# EasyEDA Pro project 2025新M0板子工程.eprj, schematic Schematic1
Board Name: Board1; Create Date: 2025-07-04; Page Name: P1; Project Name: 2025新M0板子工程; Schematic Name: Schematic1; Update Date: 2025-07-05; Company: 嘉立创EDA; Page Size: A4; Version: V1.0
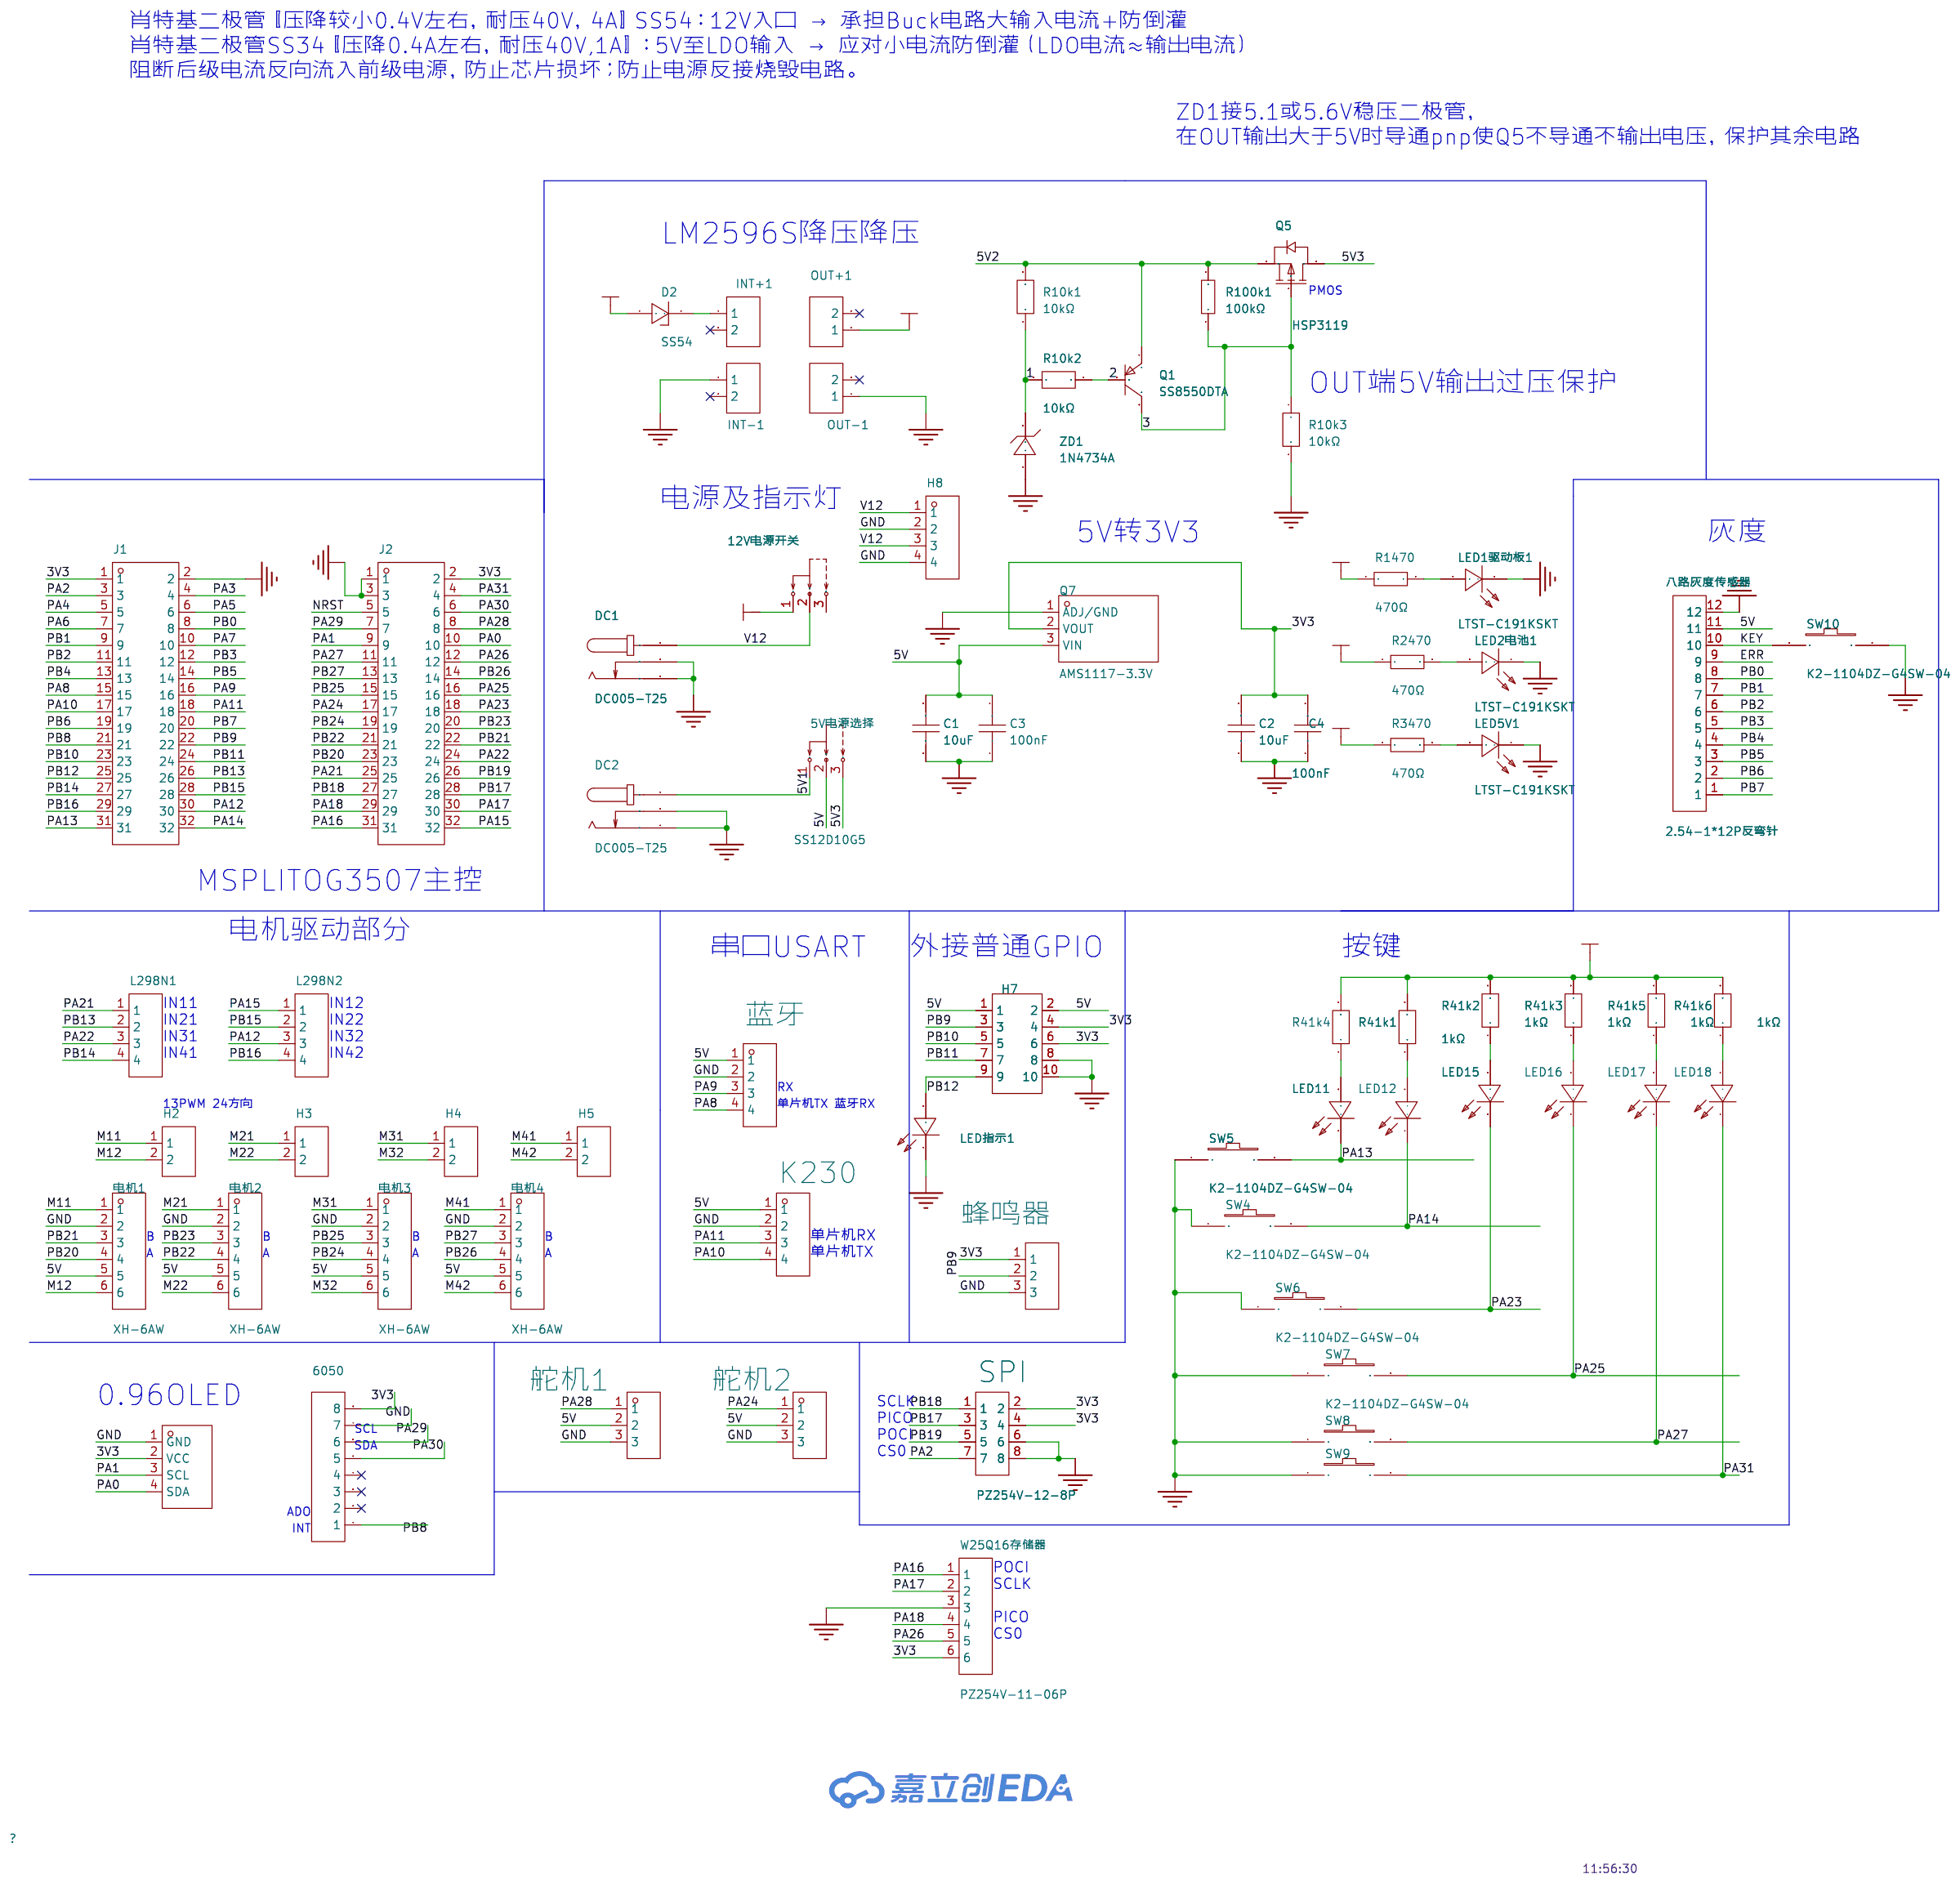
[diagram p0: schematic sheet]

## Parts
5V电源选择  SS12D10G5  [SW-TH_SHOU-HAN_SS12D10G4]
12V电源开关  SS12D10G5  [SW-TH_SHOU-HAN_SS12D10G4]
6050  2.54-1*8P母环保  [HDR-TH_8P-P2.54-V-F-1]
C1  10uF  [C0805]
C2  10uF  [C0805]
C3  100nF  [C0603]
C4  100nF  [C0603]
D2  SS54  [SMA_L4.3-W2.6-LS5.0-FD]
DC1  DC005-T25  [DC-IN-TH_DC-005-20A-1]
DC2  DC005-T25  [DC-IN-TH_DC-005-20A-1]
H2  PZ254V-11-02P  [HDR-TH_2P-P2.54-V-M]
H3  PZ254V-11-02P  [HDR-TH_2P-P2.54-V-M]
H4  PZ254V-11-02P  [HDR-TH_2P-P2.54-V-M]
H5  PZ254V-11-02P  [HDR-TH_2P-P2.54-V-M]
H7  PZ254V-12-10P  [HDR-TH_10P-P2.54-V-M-R2-C5-S2.54]
H8  PZ254V-11-04P  [HDR-TH_4P-P2.54-V-M]
INT+1  2.54-1*2P母  [HDR-TH_2P-P2.54-V-F]
INT-1  2.54-1*2P母  [HDR-TH_2P-P2.54-V-F]
J1  X6521FV-2x16-C85D32  [HDR-TH_32P-P2.54-V-F-R2-C16-S2.54]
J2  X6521FV-2x16-C85D32  [HDR-TH_32P-P2.54-V-F-R2-C16-S2.54]
K230  PZ254V-11-04P  [HDR-TH_4P-P2.54-V-M]
L298N1  2.54-1*4  [HDR-TH_4P-P2.54-V-M-1]
L298N2  2.54-1*4  [HDR-TH_4P-P2.54-V-M-1]
LED1驱动板1  LTST-C191KSKT  [LED0603-RD-YELLOW]
LED2电池1  LTST-C191KSKT  [LED0603-RD-YELLOW]
LED5V1  LTST-C191KSKT  [LED0603-RD-YELLOW]
LED11  LTST-C191KSKT  [LED0603-RD-YELLOW]
LED12  LTST-C191KSKT  [LED0603-RD-YELLOW]
LED15  LTST-C191KSKT  [LED0603-RD-YELLOW]
LED16  LTST-C191KSKT  [LED0603-RD-YELLOW]
LED17  LTST-C191KSKT  [LED0603-RD-YELLOW]
LED18  LTST-C191KSKT  [LED0603-RD-YELLOW]
LED指示1  LTST-C191KSKT  [LED0603-RD-YELLOW]
OLED1  HS96L03W2C03  [OLED-TH_L27.8-W27.2-P2.54_C9900033791]
OUT+1  2.54-1*2P母  [HDR-TH_2P-P2.54-V-F]
OUT-1  2.54-1*2P母  [HDR-TH_2P-P2.54-V-F]
Q1  SS8550DTA  [TO-92-3_L4.8-W3.7-P2.54-L]
Q5  HSP3119  [TO-220-3_L10.2-W4.5-P2.54-L-1]
Q7  AMS1117-3.3V  [SOT-89-3_L4.5-W2.5-P1.50-LS4.2-BR]
R10k1  10kΩ  [RES-TH_BD2.4-L6.3-P10.30-D0.6]
R10k2  10kΩ  [RES-TH_BD2.4-L6.3-P10.30-D0.6]
R10k3  10kΩ  [RES-TH_BD2.4-L6.3-P10.30-D0.6]
R41k1  1kΩ  [R0603]
R41k2  1kΩ  [R0603]
R41k3  1kΩ  [R0603]
R41k4  1kΩ  [R0603]
R41k5  1kΩ  [R0603]
R41k6  1kΩ  [R0603]
R100k1  100kΩ  [RES-TH_BD2.7-L6.2-P10.20-D0.4]
R1470  470Ω  [R0603]
R2470  470Ω  [R0603]
R3470  470Ω  [R0603]
SPI  PZ254V-12-8P  [HDR-TH_8P-P2.54-V-M-R2-C4-S2.54]
SW4  K2-1104DZ-G4SW-04  [KEY-TH_2P-L6.0-W6.0-P5.00]
SW5  K2-1104DZ-G4SW-04  [KEY-TH_2P-L6.0-W6.0-P5.00]
SW6  K2-1104DZ-G4SW-04  [KEY-TH_2P-L6.0-W6.0-P5.00]
SW7  K2-1104DZ-G4SW-04  [KEY-TH_2P-L6.0-W6.0-P5.00]
SW8  K2-1104DZ-G4SW-04  [KEY-TH_2P-L6.0-W6.0-P5.00]
SW9  K2-1104DZ-G4SW-04  [KEY-TH_2P-L6.0-W6.0-P5.00]
SW10  K2-1104DZ-G4SW-04  [KEY-TH_2P-L6.0-W6.0-P5.00]
W25Q16存储器  PZ254V-11-06P  [HDR-TH_6P-P2.54-V-M]
ZD1  1N4734A  [DO-41_BD2.8-L4.2-P8.00-D0.7-FD]
八路灰度传感器  2.54-1*12P反弯针  [HDR-TH_12P-P2.54-H-M-W10.5]
电机1  XH-6AW  [CONN-TH_6P-P2.54_HCTL_XH-6AW_C2908615]
电机2  XH-6AW  [CONN-TH_6P-P2.54_HCTL_XH-6AW_C2908615]
电机3  XH-6AW  [CONN-TH_6P-P2.54_HCTL_XH-6AW_C2908615]
电机4  XH-6AW  [CONN-TH_6P-P2.54_HCTL_XH-6AW_C2908615]
舵机1  舵机  [HDR-TH_3P-P2.54-V-F]
舵机2  舵机  [HDR-TH_3P-P2.54-V-F]
蓝牙  2.54-1*4P母  [HDR-TH_4P-P2.54-V-F]
蜂鸣器  PZ254V-11-03P  [HDR-TH_3P-P2.54-V-M]

## Library data of the parts
5V电源选择 12V电源开关 = SS12D10G5: 电路结构:单刀双掷;安装方式:直插;额定电流(DC):2A;额定电压(DC):125V;机械寿命:3千次;; LCSC Part Name: 两档立式插件 3脚拨动开关 柄长5.0mm; Supplier Part: C7431054; Manufacturer: SHOU HAN(首韩); Supplier Footprint: 插件; JLCPCB Part Class: 扩展库; Datasheet: https://atta.szlcsc.com/upload/public/pdf/source/20231130/7A3DB6A149BF0A1DCFFE64FFC07FE434.pdf; Supplier: LCSC; Circuit: 单刀双掷; Switch Length: 12.7mm; Switch Width: 6.7mm; Mounting Style: 直插; Current Rating (DC): 2A; Voltage Rating (DC): 125V; Mechanical Life: 3千次; Operating Temperature: -25℃~+70℃
6050 = 2.54-1*8P母环保: 插孔结构:1x8P;间距:2.54mm;行距:-;安装类型:直插;排数:单排;总孔位数:8P;塑高:-;触头材质:-;触头镀层:-;; LCSC Part Name: 间距:2.54mm 1x8P 直插; Supplier Part: C27438; Manufacturer: BOOMELE(博穆精密); Supplier Footprint: 插件,P=2.54mm; JLCPCB Part Class: 扩展库; Datasheet: https://atta.szlcsc.com/upload/public/pdf/source/20231221/1CA800C6799ED97958773716FAA1BFFE.pdf; Supplier: LCSC; Holes Structure: 1x8P; Pitch: 2.54mm; Mounting Type: 直插; Number of Rows: 单排; Number of Holes: 8P
C1 C2 = CGA0805X5R106K250MT: LCSC Part Name: 10uF ±10% 25V; Supplier Part: C6119887; Manufacturer: HRE(芯声); Supplier Footprint: 0805; JLCPCB Part Class: 扩展库; Supplier: LCSC; Tolerance: ±10%; Voltage Rating: 25V; Temperature Coefficient: X5R
C3 C4 = CGA0603X7R104K500JT: LCSC Part Name: 100nF ±10% 50V; Supplier Part: C6119867; Manufacturer: HRE(芯声); Supplier Footprint: 0603; JLCPCB Part Class: 扩展库; Datasheet: https://atta.szlcsc.com/upload/public/pdf/source/20250103/C44077DA9E7B3EFAE02F22B6D3D1CBC9.pdf; Supplier: LCSC; Tolerance: ±10%; Voltage Rating: 50V; Temperature Coefficient: X7R
D2 = SS54_C7420369: LCSC Part Name: 电压:40V 电流:5A; Supplier Part: C7420369; Manufacturer: 宏迦橙; Supplier Footprint: SMA(DO-214AC); JLCPCB Part Class: 扩展库; Datasheet: https://atta.szlcsc.com/upload/public/pdf/source/20230828/254C3882F8647358AD9F60DD73611B5E.pdf; Supplier: LCSC; Diode Configuration: 独立式; Forward Voltage (Vf@If): 550mV@5.0A; Reverse Voltage (Vr): 40V; Rectified Current: 5A; Reverse Leakage Current (Ir): 50uA@40V
DC1 DC2 = DC005-T25: 触点内径:2.5mm;触点外径:6.3mm;额定电流:-;额定电压:-;; LCSC Part Name: 内径:2.5mm 外径:6.3mm; Supplier Part: C111573; Manufacturer: SOFNG(硕方); Supplier Footprint: 插件; JLCPCB Part Class: 扩展库; Datasheet: https://atta.szlcsc.com/upload/public/pdf/source/20211217/AAF92010038535095742900872F779AE.pdf; Supplier: LCSC; Inside Contact Diameter: 2.5mm; Outside Contact Diameter: 6.3mm
H2-H5 = PZ254V-11-02P: LCSC Part Name: 1x2P 间距:2.54mm 方针 直插; Supplier Part: C492401; Manufacturer: XFCN(兴飞); Supplier Footprint: 插件,P=2.54mm; JLCPCB Part Class: 扩展库; Datasheet: https://atta.szlcsc.com/upload/public/pdf/source/20200309/C492401_A812433581A9B211A7FFA413ADDFF0E5.pdf; Supplier: LCSC; Pin Structure: 1x2P; Pitch: 2.54mm; Circluar Pins/Square Pins: 方针; Mounting Type: 直插; Number of Rows: 单排; Number of Pins: 2P; Length of Mating Pin: 6mm; Insulation Height: 2.5mm; Length of End Connection Pin: 3mm; Contact Material: 黄铜; Operating Temperature: -40℃~+105℃; Color: 黑色
H7 = PZ254V-12-10P: LCSC Part Name: 2x5P 间距:2.54mm 方针 直插; Supplier Part: C492422; Manufacturer: XFCN(兴飞); Supplier Footprint: 插件,P=2.54mm; JLCPCB Part Class: 扩展库; Datasheet: https://atta.szlcsc.com/upload/public/pdf/source/20200309/C492422_5020CEA01BE7051F9EA9DD81AB0A25E3.pdf; Supplier: LCSC; Pin Structure: 2x5P; Pitch: 2.54mm; Row Spacing: 2.54mm; Circluar Pins/Square Pins: 方针; Mounting Type: 直插; Number of Rows: 双排; Number of Pins: 10P; Length of Mating Pin: 6mm; Insulation Height: 2.5mm; Length of End Connection Pin: 3mm; Contact Material: 黄铜; Operating Temperature: -40℃~+105℃; Color: 黑色
H8 K230 = PZ254V-11-04P: 插针结构:1x4P;间距:2.54mm;行距:-;圆针/方针:方针;安装类型:直插;排数:单排;总PIN位数:4P;额定电流:3A;额定电压:250V;配合针长度:6mm;塑高:2.5mm;端接针长度:3mm;触头材质:-;工作温度范围:-40℃~+105℃;颜色:黑色;; LCSC Part Name: 间距:2.54mm 1x4P 直插 方针; Supplier Part: C2691448; Manufacturer: XFCN(兴飞); Supplier Footprint: 插件,P=2.54mm; JLCPCB Part Class: 扩展库; Datasheet: https://atta.szlcsc.com/upload/public/pdf/source/20200309/C492403_F9F19131791D08044AD4F84F8E751A34.pdf; Supplier: LCSC; Pin Structure: 1x4P; Pitch: 2.54mm; Circluar Pins/Square Pins: 方针; Mounting Type: 直插; Number of Rows: 单排; Number of Pins: 4P; Current Rating (Max): 3A; Voltage Rating (Max): 250V; Length of Mating Pin: 6mm; Insulation Height: 2.5mm; Length of End Connection Pin: 3mm; Operating Temperature Range: -40℃~+105℃; Color: 黑色
INT+1 INT-1 OUT+1 OUT-1 = 2.54-1*2P母: 插孔结构:1x2P;间距:2.54mm;行距:-;安装类型:直插;排数:单排;总孔位数:2P;塑高:-;触头材质:-;触头镀层:-;; LCSC Part Name: 间距:2.54mm 1x2P 直插; Supplier Part: C49661; Manufacturer: BOOMELE(博穆精密); Supplier Footprint: 插件,P=2.54mm; JLCPCB Part Class: 扩展库; Datasheet: https://atta.szlcsc.com/upload/public/pdf/source/20210301/C2718488_F4427B881E42CAA8DDB0B1C12B3A522C.pdf; Supplier: LCSC; Holes Structure: 1x2P; Pitch: 2.54mm; Mounting Type: 直插; Number of Rows: 单排; Number of Holes: 2P
J1 J2 = X6521FV-2x16-C85D32: LCSC Part Name: 间距:2.54mm 2x16P 直插; Supplier Part: C2883989; Manufacturer: XKB Connection(中国星坤); Supplier Footprint: 插件,P=2.54mm; JLCPCB Part Class: 扩展库; Datasheet: https://atta.szlcsc.com/upload/public/pdf/source/20211009/C636DBF0733662F7F428F4420CCBBD46.pdf; Supplier: LCSC; Holes Structure: 2x16P; Pitch: 2.54mm; Row Spacing: 2.54mm; Circular Hole / Square Hole: 方孔; Mounting Type: 直插; Number of Rows: 双排; Number of Holes: 32P; Current Rating (Max): 3A; Voltage Rating (Max): 250V; Holes Direction: 顶部; Insulation Height: 8.5mm; Contact Material: 黄铜; Contact Plating: 金; Operating Temperature Range: -40℃~+105℃; Soldering Temperature(Max): 260℃
L298N1 L298N2 = 2.54-1*4: Supplier Part: C5116483; Manufacturer: ZHOURI(洲日); Supplier Footprint: 插件,P=2.54mm; JLCPCB Part Class: 扩展库; Datasheet: https://atta.szlcsc.com/upload/public/pdf/source/20250227/F941FC765EF241ABFB2D5D72948A31A5.pdf; Supplier: LCSC; Pin Structure: 1x4P; Pitch: 2.54mm; Number of Rows: 单排; Number of Pins: 4P
LED1驱动板1 LED2电池1 LED5V1 LED11 LED12 LED15-LED18 LED指示1 = LTST-C191KSKT: 发光颜色:黄色;正向电压(VF):2.1V;功率:75mW;正向电流:20mA;主波长:584.5nm~597nm;二极管配置:-;透镜颜色:无色透明透镜;色温:-;发光强度:104mcd;发光角度:130°;载带方式:-;工作温度:-55℃~+85℃;; LCSC Part Name: 黄灯; Supplier Part: C125100; Manufacturer: LITEON(光宝); Supplier Footprint: 0603; JLCPCB Part Class: 扩展库; Datasheet: https://atta.szlcsc.com/upload/public/pdf/source/20180129/C125100_15171877314981315871.pdf; Supplier: LCSC; Emitted Color: 黄色; Forward Voltage (VF): 2.1V; Power Dissipation: 75mW; Forward Current: 20mA; Dominant Wavelength: 584.5nm~597nm; Peak Wavelength: 588nm; Lens Color: 无色透明透镜; Luminous Intensity: 104mcd; Viewing Angle: 130°; Operating Temperature: -55℃~+85℃
OLED1 = HS96L03W2C03: 主控芯片:SSD1315;接口类型:I2C;尺寸(inch):0.96;像素分辨率:128x64;; LCSC Part Name: 0.96寸OLED显示屏窄白光IIC; Supplier Part: C5248080; Manufacturer: HS(汉昇); JLCPCB Part Class: 扩展库; Datasheet: https://atta.szlcsc.com/upload/public/pdf/source/20230627/763D01F79A90007632F098068C7C8AD9.pdf; Supplier: LCSC; Main Control Chip: SSD1315; Interface Type: I2C; Size: 0.96; Pixel Resolution: 128x64; Operating Temperature: -40℃~+70℃
Q1 = SS8550DTA: 晶体管类型:PNP;集电极电流(Ic):1.5A;集射极击穿电压(Vceo):25V;功率(Pd):2W;直流电流增益(hFE@Ic,Vce):40@800mA,1V;; LCSC Part Name: PNP 电流:1.5A 耐压:25V; Supplier Part: C903228; Manufacturer: onsemi(安森美); Supplier Footprint: TO-92-3; JLCPCB Part Class: Extended Part; Datasheet: https://atta.szlcsc.com/upload/public/pdf/source/20221020/9DBCD1C6A257D06DE4F9043ED0140297.pdf; Supplier: LCSC; Transistor Type: PNP; Collector Current (Ic): 1.5A; Collector-Emitter Breakdown Voltage (Vceo): 25V; Power Dissipation (Pd): 2W; DC Current Gain (hFE@Ic,Vce): 40@800mA,1V; Transition Frequency (fT): 100MHz; Collector Cut-Off Current (Icbo): 100nA; Collector-Emitter Saturation Voltage (VCE(sat)@Ic,Ib): 280mV@800mA,80mA; Operating Temperature: -65℃~+150℃
Q5 = HSP3119: 类型:1个P沟道;漏源电压(Vdss):30V;连续漏极电流(Id):150A;导通电阻(RDS(on)):-;耗散功率(Pd):200W;阈值电压(Vgs(th)):2.5V;; LCSC Part Name: 1个P沟道 耐压:30V 电流:150A; Supplier Part: C22359262; Manufacturer: HUASHUO(华朔); Supplier Footprint: TO-220; JLCPCB Part Class: Extended Part; Datasheet: https://atta.szlcsc.com/upload/public/pdf/source/20240313/B2043F85A28365E5AF5F107A9C9B0F2E.pdf; Supplier: LCSC; Type: 1个P沟道; Drain to Source Voltage: 30V; Current - Continuous Drain(Id): 150A; Pd - Power Dissipation: 200W; Gate Threshold Voltage (Vgs(th)@Id): 2.5V; Input Capacitance(Ciss@Vds): 12.7nF@15V; Reverse Transfer Capacitance (Crss@Vds): 1.21nF@15V; Operating Temperature: -55℃~+150℃@(Tj)
Q7 = AMS1117-3.3V_C5120796: LCSC Part Name: 输入18V 输出3.3V 1A; Supplier Part: C5120796; Manufacturer: MSKSEMI(美森科); Supplier Footprint: SOT-89; JLCPCB Part Class: 扩展库; Datasheet: https://atta.szlcsc.com/upload/public/pdf/source/20240731/7960C38D2F7D4AC8FF3CFA386029A4C5.pdf; Supplier: LCSC; Output Type: 固定; Voltage - Supply: 18V; Output Voltage: 3.3V; Output Current: 1A; Voltage Dropout: 1.4V@(1A); standby current: 12mA; Operating Temperature: 0℃~+125℃; Output Configuration: 正极; Number of Outputs: 1
R10k1-R10k3 = RN1/4W10KFT/BA1: 电阻类型:金属膜电阻;阻值:10kΩ;精度:±1%;功率:250mW;温度系数:±50ppm/℃;; LCSC Part Name: 10kΩ ±1% 250mW 金属膜电阻; Supplier Part: C410695; Manufacturer: Tyohm(幸亚电阻); Supplier Footprint: 插件,D2.4xL6.5mm; JLCPCB Part Class: Extended Part; Datasheet: https://atta.szlcsc.com/upload/public/pdf/source/20190808/C410699_D126E64D28B638F1D73B58E9F61DFD9B.pdf; Supplier: LCSC; Type: 金属膜电阻; Tolerance: ±1%; Overload Voltage (Max): 250V; Power(Watts): 250mW; Temperature Coefficient: ±50ppm/℃; Operating Temperature Range: -55℃~+125℃
R41k1-R41k6 = FCR0603F1K: 电阻类型:厚膜电阻;阻值:1kΩ;精度:±1%;功率:100mW;最大工作电压:75V;; LCSC Part Name: 1K ±1%; Supplier Part: C5913168; Manufacturer: VO(翔胜); Supplier Footprint: 0603; JLCPCB Part Class: 扩展库; Datasheet: https://atta.szlcsc.com/upload/public/pdf/source/20230428/98B65D379E9BA4CF2A9223D1647B01B6.pdf; Supplier: LCSC; Type: 厚膜电阻; Tolerance: ±1%; Power(Watts): 100mW; Overload Voltage (Max): 75V; Operating Temperature Range: -55℃~+155℃
R100k1 = MF1/4W-100K±1%-OT26: 电阻类型:金属膜电阻;阻值:100kΩ;精度:±1%;功率:250mW;温度系数:±350ppm/℃;; LCSC Part Name: 金属膜电阻 100kΩ ±1% 250mW; Supplier Part: C2843019; Manufacturer: VO(翔胜); Supplier Footprint: 插件,D2.7xL6.2mm; JLCPCB Part Class: Extended Part; Datasheet: https://atta.szlcsc.com/upload/public/pdf/source/20200609/C601728_5AA4C0C8E12E11069DA2C3356F29D1F2.pdf; Supplier: LCSC; Type: 金属膜电阻; Tolerance: ±1%; Overload Voltage (Max): 250V; Power(Watts): 250mW; Temperature Coefficient: ±350ppm/℃; Operating Temperature Range: -55℃~+155℃
R1470 R2470 R3470 = 0603WAF4700T5E: 电阻类型:厚膜电阻;阻值:470Ω;精度:±1%;功率:100mW;最大工作电压:75V;温度系数:±100ppm/℃;; LCSC Part Name: 470Ω ±1% 100mW 厚膜电阻; Supplier Part: C23179; Manufacturer: UNI-ROYAL(厚声); Supplier Footprint: 0603; JLCPCB Part Class: 基础库; Datasheet: https://atta.szlcsc.com/upload/public/pdf/source/20200306/C422600_1E6D84923E4A46A82E41ADD87F860B5C.pdf; Supplier: LCSC; Type: 厚膜电阻; Tolerance: ±1%; Power(Watts): 100mW; Overload Voltage (Max): 75V; Temperature Coefficient: ±100ppm/℃; Operating Temperature Range: -55℃~+155℃
SPI = PZ254V-12-8P: LCSC Part Name: 2x4P 间距:2.54mm 方针 直插; Supplier Part: C492421; Manufacturer: XFCN(兴飞); Supplier Footprint: 插件,P=2.54mm; JLCPCB Part Class: 扩展库; Datasheet: https://atta.szlcsc.com/upload/public/pdf/source/20200309/C492421_DC8A206AF99CD7755BD4A5B0BC48200B.pdf; Supplier: LCSC; Pin Structure: 2x4P; Pitch: 2.54mm; Row Spacing: 2.54mm; Circluar Pins/Square Pins: 方针; Mounting Type: 直插; Number of Rows: 双排; Number of Pins: 8P; Length of Mating Pin: 6mm; Insulation Height: 2.5mm; Length of End Connection Pin: 3mm; Contact Material: 黄铜; Operating Temperature: -40℃~+105℃; Color: 黑色
SW4-SW10 = K2-1104DZ-G4SW-04: 作用力:250gf;安装方式:直插;开关长度:6mm;开关宽度:6mm;开关高度:7mm;触点电流:50mA;额定电压(DC):12V;绝缘电阻:100MΩ;机械寿命:10万次;; LCSC Part Name: 6*6*7 两脚长脚开关; Supplier Part: C961736; Manufacturer: 韩国韩荣; Supplier Footprint: 插件; JLCPCB Part Class: 扩展库; Datasheet: https://atta.szlcsc.com/upload/public/pdf/source/20201126/C961736_4F85C6E6E5B3656D5DC7C0B00D034F4A.pdf; Supplier: LCSC; Operating Force: 250gf; Mounting Style: 直插; Switch Length: 6mm; Switch Width: 6mm; Switch Height: 7mm; Contact Current: 50mA; Voltage Rating (DC): 12V; Insulation Resistance: 100MΩ; Mechanical Life: 10万次; Operating Temperature: -25℃~+85℃
W25Q16存储器 = PZ254V-11-06P: LCSC Part Name: 1x6P 间距:2.54mm 方针 直插; Supplier Part: C492405; Manufacturer: XFCN(兴飞); Supplier Footprint: 插件,P=2.54mm; JLCPCB Part Class: 扩展库; Datasheet: https://atta.szlcsc.com/upload/public/pdf/source/20200309/C492405_597F1930F5B55CC3C7FD95458F1C3977.pdf; Supplier: LCSC; Pin Structure: 1x6P; Pitch: 2.54mm; Circluar Pins/Square Pins: 方针; Mounting Type: 直插; Number of Rows: 单排; Number of Pins: 6P; Length of Mating Pin: 6mm; Insulation Height: 2.5mm; Length of End Connection Pin: 3mm; Contact Material: 黄铜; Operating Temperature: -40℃~+105℃; Color: 黑色
ZD1 = 1N4734A_C41430: 二极管配置:独立式;稳压值(标称值):5.6V;耗散功率(Pd):-;; LCSC Part Name: 编带 1N4734A; Supplier Part: C41430; Manufacturer: ST(先科); Supplier Footprint: DO-41; JLCPCB Part Class: Extended Part; Datasheet: https://atta.szlcsc.com/upload/public/pdf/source/20170719/C118641_1500457766301828347.pdf; Supplier: LCSC; Diode Configuration: 独立式; Zener Voltage(Nom): 5.6V; Reverse Leakage Current (Ir): 10uA@2V; Impedance(Zzt): 5Ω
八路灰度传感器 = 2.54-1*12P反弯针_C725243: LCSC Part Name: 1x12P 间距:2.54mm 方针 弯插; Supplier Part: C725243; Manufacturer: BOOMELE(博穆精密); Supplier Footprint: 弯插,P=2.54mm; JLCPCB Part Class: 扩展库; Datasheet: https://atta.szlcsc.com/upload/public/pdf/source/20190508/C74252_03DDEC4696EE17172E44B96636392962.pdf; Supplier: LCSC; Pin Structure: 1x12P; Pitch: 2.54mm; Circluar Pins/Square Pins: 方针; Mounting Type: 弯插; Number of Rows: 单排; Number of Pins: 12P; Current Rating: 3A; Length of Mating Pin: 6mm; Operating Temperature: -55℃~+105℃; Color: 黑色
电机1-电机4 = XH-6AW: LCSC Part Name: 1x6P 间距:2.5mm 弯插 系列:XH; Supplier Part: C2908615; Manufacturer: HCTL(华灿天禄); Supplier Footprint: 弯插,P=2.5mm; JLCPCB Part Class: 扩展库; Datasheet: https://atta.szlcsc.com/upload/public/pdf/source/20230711/B565BAF3B11666EF6B81B3605408F2BD.pdf; Supplier: LCSC; Pins Structure: 1x6P; Pitch: 2.5mm; Mounting Style: 弯插; Reference Series: XH; Number of Pins: 6P; Number of Rows: 1; Number of PINs Per Row: 6; Current Rating (Max): 3A; Contact Material: 黄铜; Contact Plating: 锡; Operating Temperature Range: -25℃~+85℃
舵机1 舵机2 = PM254V-11-03-H85: 插孔结构:1x3P;间距:2.54mm;行距:-;安装类型:直插;排数:单排;总孔位数:3P;塑高:-;触头材质:黄铜;触头镀层:-;; LCSC Part Name: 间距:2.54mm 1x3P 直插; Supplier Part: C541850; Manufacturer: XFCN(兴飞); Supplier Footprint: 插件,P=2.54mm; JLCPCB Part Class: 扩展库; Datasheet: https://atta.szlcsc.com/upload/public/pdf/source/20200518/C541849_85853D71FC67C51915A806977A588FDA.pdf; Supplier: LCSC; Holes Structure: 1x3P; Pitch: 2.54mm; Mounting Type: 直插; Number of Rows: 单排; Number of Holes: 3P; Contact Material: 黄铜
蓝牙 = 2.54-1*4P母: 插孔结构:1x4P;间距:2.54mm;行距:-;圆孔/方孔:方孔;安装类型:直插;排数:单排;总孔位数:4P;额定电流:3A;额定电压:-;插孔方向:顶部;塑高:-;触头材质:青铜;触头镀层:-;工作温度范围:-40℃~+105℃;焊接温度(最大值):-;; LCSC Part Name: 间距:2.54mm 1x4P 直插; Supplier Part: C2718488; Manufacturer: BOOMELE(博穆精密); Supplier Footprint: 插件,P=2.54mm; JLCPCB Part Class: 扩展库; Datasheet: https://atta.szlcsc.com/upload/public/pdf/source/20210301/C2718488_F4427B881E42CAA8DDB0B1C12B3A522C.pdf; Supplier: LCSC; Holes Structure: 1x4P; Pitch: 2.54mm; Circular Hole / Square Hole: 方孔; Mounting Type: 直插; Number of Rows: 单排; Number of Holes: 4P; Current Rating (Max): 3A; Holes Direction: 顶部; Contact Material: 青铜; Operating Temperature Range: -40℃~+105℃
蜂鸣器 = PZ254V-11-03P: 插针结构:1x3P;间距:2.54mm;行距:-;圆针/方针:方针;安装方式:直插;排数:单排;总PIN位数:3P;额定电流:3A;额定电压:250V;配合针长度:6mm;塑高:2.5mm;端接针长度:3mm;工作温度:-40℃~+105℃;颜色:黑色;; LCSC Part Name: 1x3P 间距:2.54mm 方针 直插; Supplier Part: C2937625; Manufacturer: XFCN(兴飞); Supplier Footprint: 插件,P=2.54mm; JLCPCB Part Class: 扩展库; Datasheet: https://atta.szlcsc.com/upload/public/pdf/source/20200309/C492402_8335C3D49C4E4C618838D59BB1D024C1.pdf; Supplier: LCSC; Pin Structure: 1x3P; Pitch: 2.54mm; Circluar Pins/Square Pins: 方针; Mounting Type: 直插; Number of Rows: 单排; Number of Pins: 3P; Current Rating: 3A; Voltage Rating (Max): 250V; Length of Mating Pin: 6mm; Insulation Height: 2.5mm; Length of End Connection Pin: 3mm; Operating Temperature: -40℃~+105℃; Color: 黑色

## Nets
3V3: 6050.8 C2.2 C4.2 H7.4 H7.6 J1.1 J2.2 OLED1.2(VCC) Q7.2(VOUT) R41k1.2 R41k2.2 R41k3.2 R41k4.2 R41k5.2 R41k6.2 R2470.1 SPI.2 SPI.4 W25Q16存储器.6 蜂鸣器.1
5V: 5V电源选择.2 C1.2 C3.2 H7.1 H7.2 K230.1 Q7.3(VIN) R3470.1 八路灰度传感器.11 电机1.5 电机2.5 电机3.5 电机4.5 舵机1.2 舵机2.2 蓝牙.1
5V1: 5V电源选择.1 DC2.1
5V2: OUT+1.1 Q1.1(E) Q5.3(S) R10k1.2 R100k1.2
5V3: 5V电源选择.3 Q5.2(D)
12V: 12V电源开关.1 D2.1(A) R1470.1
GND: 6050.7 C1.1 C2.1 C3.1 C4.1 DC1.2 DC1.3 DC2.2 DC2.3 H7.8 H7.10 H8.2 H8.4 INT-1.1 J1.2 J2.1 J2.3 K230.2 LED1驱动板1.1(-) LED2电池1.1(-) LED5V1.1(-) LED指示1.1(-) OLED1.1(GND) OUT-1.1 Q7.1(ADJ/GND) R10k3.2 SPI.6 SPI.8 SW4.1 SW5.1 SW6.1 SW7.1 SW8.1 SW9.1 SW10.2 W25Q16存储器.3 ZD1.1(A) 八路灰度传感器.12 电机1.2 电机2.2 电机3.2 电机4.2 舵机1.3 舵机2.3 蓝牙.2 蜂鸣器.3
V12: 12V电源开关.2 DC1.1 H8.1 H8.3
1: R10k1.1 R10k2.2 ZD1.2(K)
2: Q1.2(B) R10k2.1
3: Q1.3(C) Q5.1(G) R10k3.1 R100k1.1
ERR: 八路灰度传感器.9
KEY: SW10.1 八路灰度传感器.10
M11: H2.1 电机1.1
M12: H2.2 电机1.6
M21: H3.1 电机2.1
M22: H3.2 电机2.6
M31: H4.1 电机3.1
M32: H4.2 电机3.6
M41: H5.1 电机4.1
M42: H5.2 电机4.6
NRST: J2.5
PA0: J2.10 OLED1.4(SDA)
PA1: J2.9 OLED1.3(SCL)
PA2: J1.3 SPI.7
PA3: J1.4
PA4: J1.5
PA5: J1.6
PA6: J1.7
PA7: J1.10
PA8: J1.15 蓝牙.4
PA9: J1.16 蓝牙.3
PA10: J1.17 K230.4
PA11: J1.18 K230.3
PA12: J1.30 L298N2.3
PA13: J1.31 LED11.1(-) SW5.2
PA14: J1.32 LED12.1(-) SW4.2
PA15: J2.32 L298N2.1
PA16: J2.31 W25Q16存储器.1
PA17: J2.30 W25Q16存储器.2
PA18: J2.29 W25Q16存储器.4
PA21: J2.25 L298N1.1
PA22: J2.24 L298N1.3
PA23: J2.18 LED15.1(-) SW6.2
PA24: J2.17 舵机2.1
PA25: J2.16 LED16.1(-) SW7.2
PA26: J2.12 W25Q16存储器.5
PA27: J2.11 LED17.1(-) SW8.2
PA28: J2.8 舵机1.1
PA29: 6050.6 J2.7
PA30: 6050.5 J2.6
PA31: J2.4 LED18.1(-) SW9.2
PB0: J1.8 八路灰度传感器.8
PB1: J1.9 八路灰度传感器.7
PB2: J1.11 八路灰度传感器.6
PB3: J1.12 八路灰度传感器.5
PB4: J1.13 八路灰度传感器.4
PB5: J1.14 八路灰度传感器.3
PB6: J1.19 八路灰度传感器.2
PB7: J1.20 八路灰度传感器.1
PB8: 6050.1 J1.21
PB9: H7.3 J1.22 蜂鸣器.2
PB10: H7.5 J1.23
PB11: H7.7 J1.24
PB12: H7.9 J1.25 LED指示1.2(+)
PB13: J1.26 L298N1.2
PB14: J1.27 L298N1.4
PB15: J1.28 L298N2.2
PB16: J1.29 L298N2.4
PB17: J2.28 SPI.3
PB18: J2.27 SPI.1
PB19: J2.26 SPI.5
PB20: J2.23 电机1.4
PB21: J2.22 电机1.3
PB22: J2.21 电机2.4
PB23: J2.20 电机2.3
PB24: J2.19 电机3.4
PB25: J2.15 电机3.3
PB26: J2.14 电机4.4
PB27: J2.13 电机4.3
$1N2660: LED11.2(+) R41k4.1
$1N2663: LED12.2(+) R41k1.1
$1N2664: LED15.2(+) R41k2.1
$1N2665: LED16.2(+) R41k3.1
$1N3106: LED17.2(+) R41k5.1
$1N3187: LED18.2(+) R41k6.1
$1N7398: D2.2(K) INT+1.1
Net-(LED1驱动板1-2): LED1驱动板1.2(+) R1470.2
Net-(LED2电池1-2): LED2电池1.2(+) R2470.2
Net-(LED5V1-2): LED5V1.2(+) R3470.2

Not connected (* = marked no-connect by the designer): 12V电源开关 3; 6050 2* 3* 4*; INT+1 2*; INT-1 2*; OUT+1 2*; OUT-1 2*

## Notes on the sheet
- 肖特基二极管【压降较小0.4V左右，耐压40V，4A】SS54：12V入口 → 承担Buck电路大输入电流+防倒灌
  肖特基二极管SS34【压降0.4A左右，耐压40V,1A】：5V至LDO输入 → 应对小电流防倒灌（LDO电流≈输出电流）
  阻断后级电流反向流入前级电源，防止芯片损坏；防止电源反接烧毁电路。
- ZD1接5.1或5.6V稳压二极管，
  在OUT输出大于5V时导通pnp使Q5不导通不输出电压，保护其余电路
- LM2596S降压降压
- PMOS
- OUT端5V输出过压保护
- 电源及指示灯
- 5V转3V3
- 灰度
- MSPLITOG3507主控
- 电机驱动部分
- 串口USART
- 外接普通GPIO
- 按键
- IN11
- IN12
- IN21
- IN22
- IN31
- IN32
- IN41
- IN42
- RX
- 13PWM 24方向
- 单片机TX 蓝牙RX
- B
- B
- B
- B
- 单片机RX
- A
- A
- A
- A
- 单片机TX
- 0.96OLED
- SCL
- PICO
- SCLK
- SDA
- POCI
- CS0
- ADO
- INT
- POCI
- SCLK
- CS0
- PICO
